# Altium schematic sheet Rajesh_Jasti_17978253_Lab1.SchDoc
size A4; DrawnBy: Rajesh_Jasti; DocumentNumber: 1; Revision: Prototype; SheetNumber: 1; SheetTotal: 1
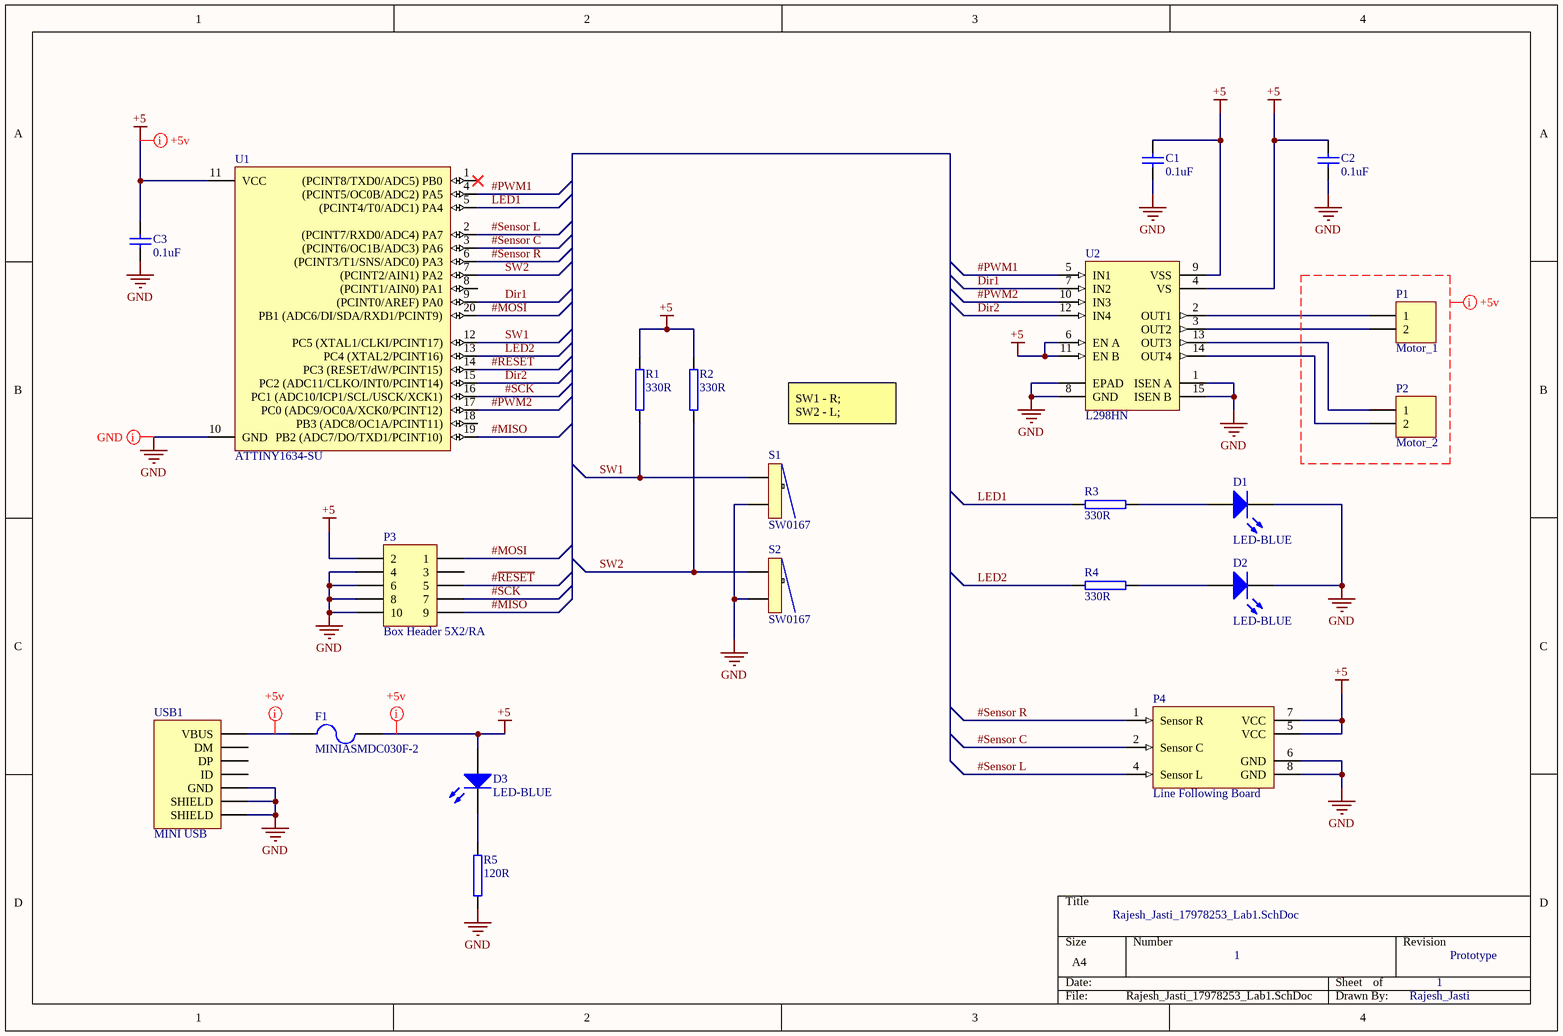
[diagram p0: Rajesh_Jasti_17978253_Lab1.SchDoc]

## Parts
C1  0.1uF  [CAP_1206]
C2  0.1uF  [CAP_1206]
C3  0.1uF  [CAP_1206]
D1  LED-BLUE  [LED1206B]
D2  LED-BLUE  [LED1206B]
D3  LED-BLUE  [LED1206B]
F1  MINIASMDC030F-2  [MINIASMDC030F-2]
P1  Motor_1  [HDR1X2_AUT]
P2  Motor_2  [HDR1X2_AUT]
P3  Box Header 5X2/RA  [FKV10SD_AUT]
P4  Line Following Board  [Line Folloing Board]
R1  330R  [RES_1206]
R2  330R  [RES_1206]
R3  330R  [RES_1206]
R4  330R  [RES_1206]
R5  120R  [RES_1206]
S1  SW0167  [SW0167]
S2  SW0167  [SW0167]
U1  ATTINY1634-SU  [20S_M]
U2  L298HN  [Multiwatt15H]
USB1  MINI USB  [USB-MINI-TH]

## Nets
+5: C1.2 C2.2 C3.2 D3.A F1.2 P3.2 P4.5(VCC) P4.7(VCC) R1.2 R2.2 U1.11(VCC) U2.4(VS) U2.6(EN_A) U2.9(VSS) U2.11(EN_B)
GND: C1.1 C2.1 C3.1 D1.K D2.K P3.4 P3.6 P3.8 P3.10 P4.6(GND) P4.8(GND) R5.1 S1.2(NO) S2.2(NO) U1.10(GND) U2.1(ISEN_A) U2.8(GND) U2.15(ISEN_B) U2.16(EPAD) USB1.5(GND) USB1.6(SHIELD) USB1.7(SHIELD)
#MISO: P3.9 U1.19(PB2_(ADC7/DO/TXD1/PCINT10))
#MOSI: P3.1 U1.20(PB1_(ADC6/DI/SDA/RXD1/PCINT9))
#PWM1: U1.4((PCINT5/OC0B/ADC2)_PA5) U2.5(IN1)
#PWM2: U1.17(PC0_(ADC9/OC0A/XCK0/PCINT12)) U2.10(IN3)
#~{RESET}: P3.5 U1.14(PC3_(RESET/dW/PCINT15))
#SCK: P3.7 U1.16(PC1_(ADC10/ICP1/SCL/USCK/XCK1))
#Sensor C: P4.2(Sensor_C) U1.3((PCINT6/OC1B/ADC3)_PA6)
#Sensor L: P4.4(Sensor_L) U1.2((PCINT7/RXD0/ADC4)_PA7)
#Sensor R: P4.1(Sensor_R) U1.6((PCINT3/T1/SNS/ADC0)_PA3)
Dir1: U1.9((PCINT0/AREF)_PA0) U2.7(IN2)
Dir2: U1.15(PC2_(ADC11/CLKO/INT0/PCINT14)) U2.12(IN4)
LED1: R3.1 U1.5((PCINT4/T0/ADC1)_PA4)
LED2: R4.1 U1.13(PC4_(XTAL2/PCINT16))
SW1: R1.1 S1.1(C) U1.12(PC5_(XTAL1/CLKI/PCINT17))
SW2: R2.1 S2.1(C) U1.7((PCINT2/AIN1)_PA2)
NetD1_A: D1.A R3.2
NetD2_A: D2.A R4.2
NetD3_K: D3.K R5.2
NetF1_1: F1.1 USB1.1(VBUS)
NetP1_1: P1.1 U2.2(OUT1)
NetP1_2: P1.2 U2.3(OUT2)
NetP2_1: P2.1 U2.13(OUT3)
NetP2_2: P2.2 U2.14(OUT4)

Not connected (* = marked no-connect by the designer): P3 3; P4 3(NC); U1 1((PCINT8/TXD0/ADC5)_PB0)* 8((PCINT1/AIN0)_PA1) 18(PB3_(ADC8/OC1A/PCINT11)); USB1 2(DM) 3(DP) 4(ID)

## Layout directives
rule Width Constraint [Pref Width = 50mil    Min Width = 20mil    Max Width = 60mil]: (no net found under the mark), +5, GND, NetF1_1

## Notes on the sheet
- SW1 - R;                                        SW2 - L;

## Library data of the parts
C1-C3 = CAPN 1206: Non Polarized Capacitor, SMD, 1206
D1-D3 = SMD 1206 LED-BLUE: BLUE  LED, Case 1206; Supplier 1: Farnell; Supplier Part Number 1: 8529965
F1 = MINIASMDC030F-2: Fuse, PTC Reset, 300mA Hold, 600mA Tripping, 30v, SMD; Supplier 1: Farnell; Supplier Part Number 1: 1876432
P1 P2 = HDR1X2V: Header, Plug, 2.54mm, 2 Pins, Straight; Supplier 1: Farnell; Supplier Part Number 1: 2254030
P3 = Box Header 5X2/RA: Header, Box, 10 Way, 2.54mm, Right Angle; Supplier 1: Farnell; Supplier Part Number 1: 1099245
P4 = Line Following Board: Connectors for Line Followinf Board; Supplier 1: Mouser; Supplier Part Number 1: 200-SSW10201FD
R1-R5 = Resistor 1206: Resistor, SMD, 1206
S1 S2 = SW0167: Micro Switch Miniature 12mm
U1 = ATTINY1634-SU: 8-bit AVR Microcontroller, 1.8-5.5V, 4KB Flash, 256 Bytes EEPROM, 256 Bytes SRAM; Supplier 1: Element14; Supplier Part Number 1: 2443186
U2 = L298HN: Dual Full Bridge Driver, Horiz; Supplier 1: Farnell; Supplier Part Number 1: 1366570
USB1 = USB-MINI-A/B TH: MINI USB TYPE A/B, RECEPTACLE, THROUGH HOLE; Supplier 1: Digi-Key; Supplier Part Number 1: 2172034-1-ND